# Altium project LimeKEY-RPCM_1v1.PrjPcb (part 7 of 12)

## Sheet 10_RFFE.SchDoc: RF front end
size A3; Organization: Lime Microsystems; Address1: Surrey Tech Centre; Address2: Guildford GU2 7YG; Address3: Surrey; Address4: United Kingdom; Revision: v1.1; SheetNumber: 10; SheetTotal: 12
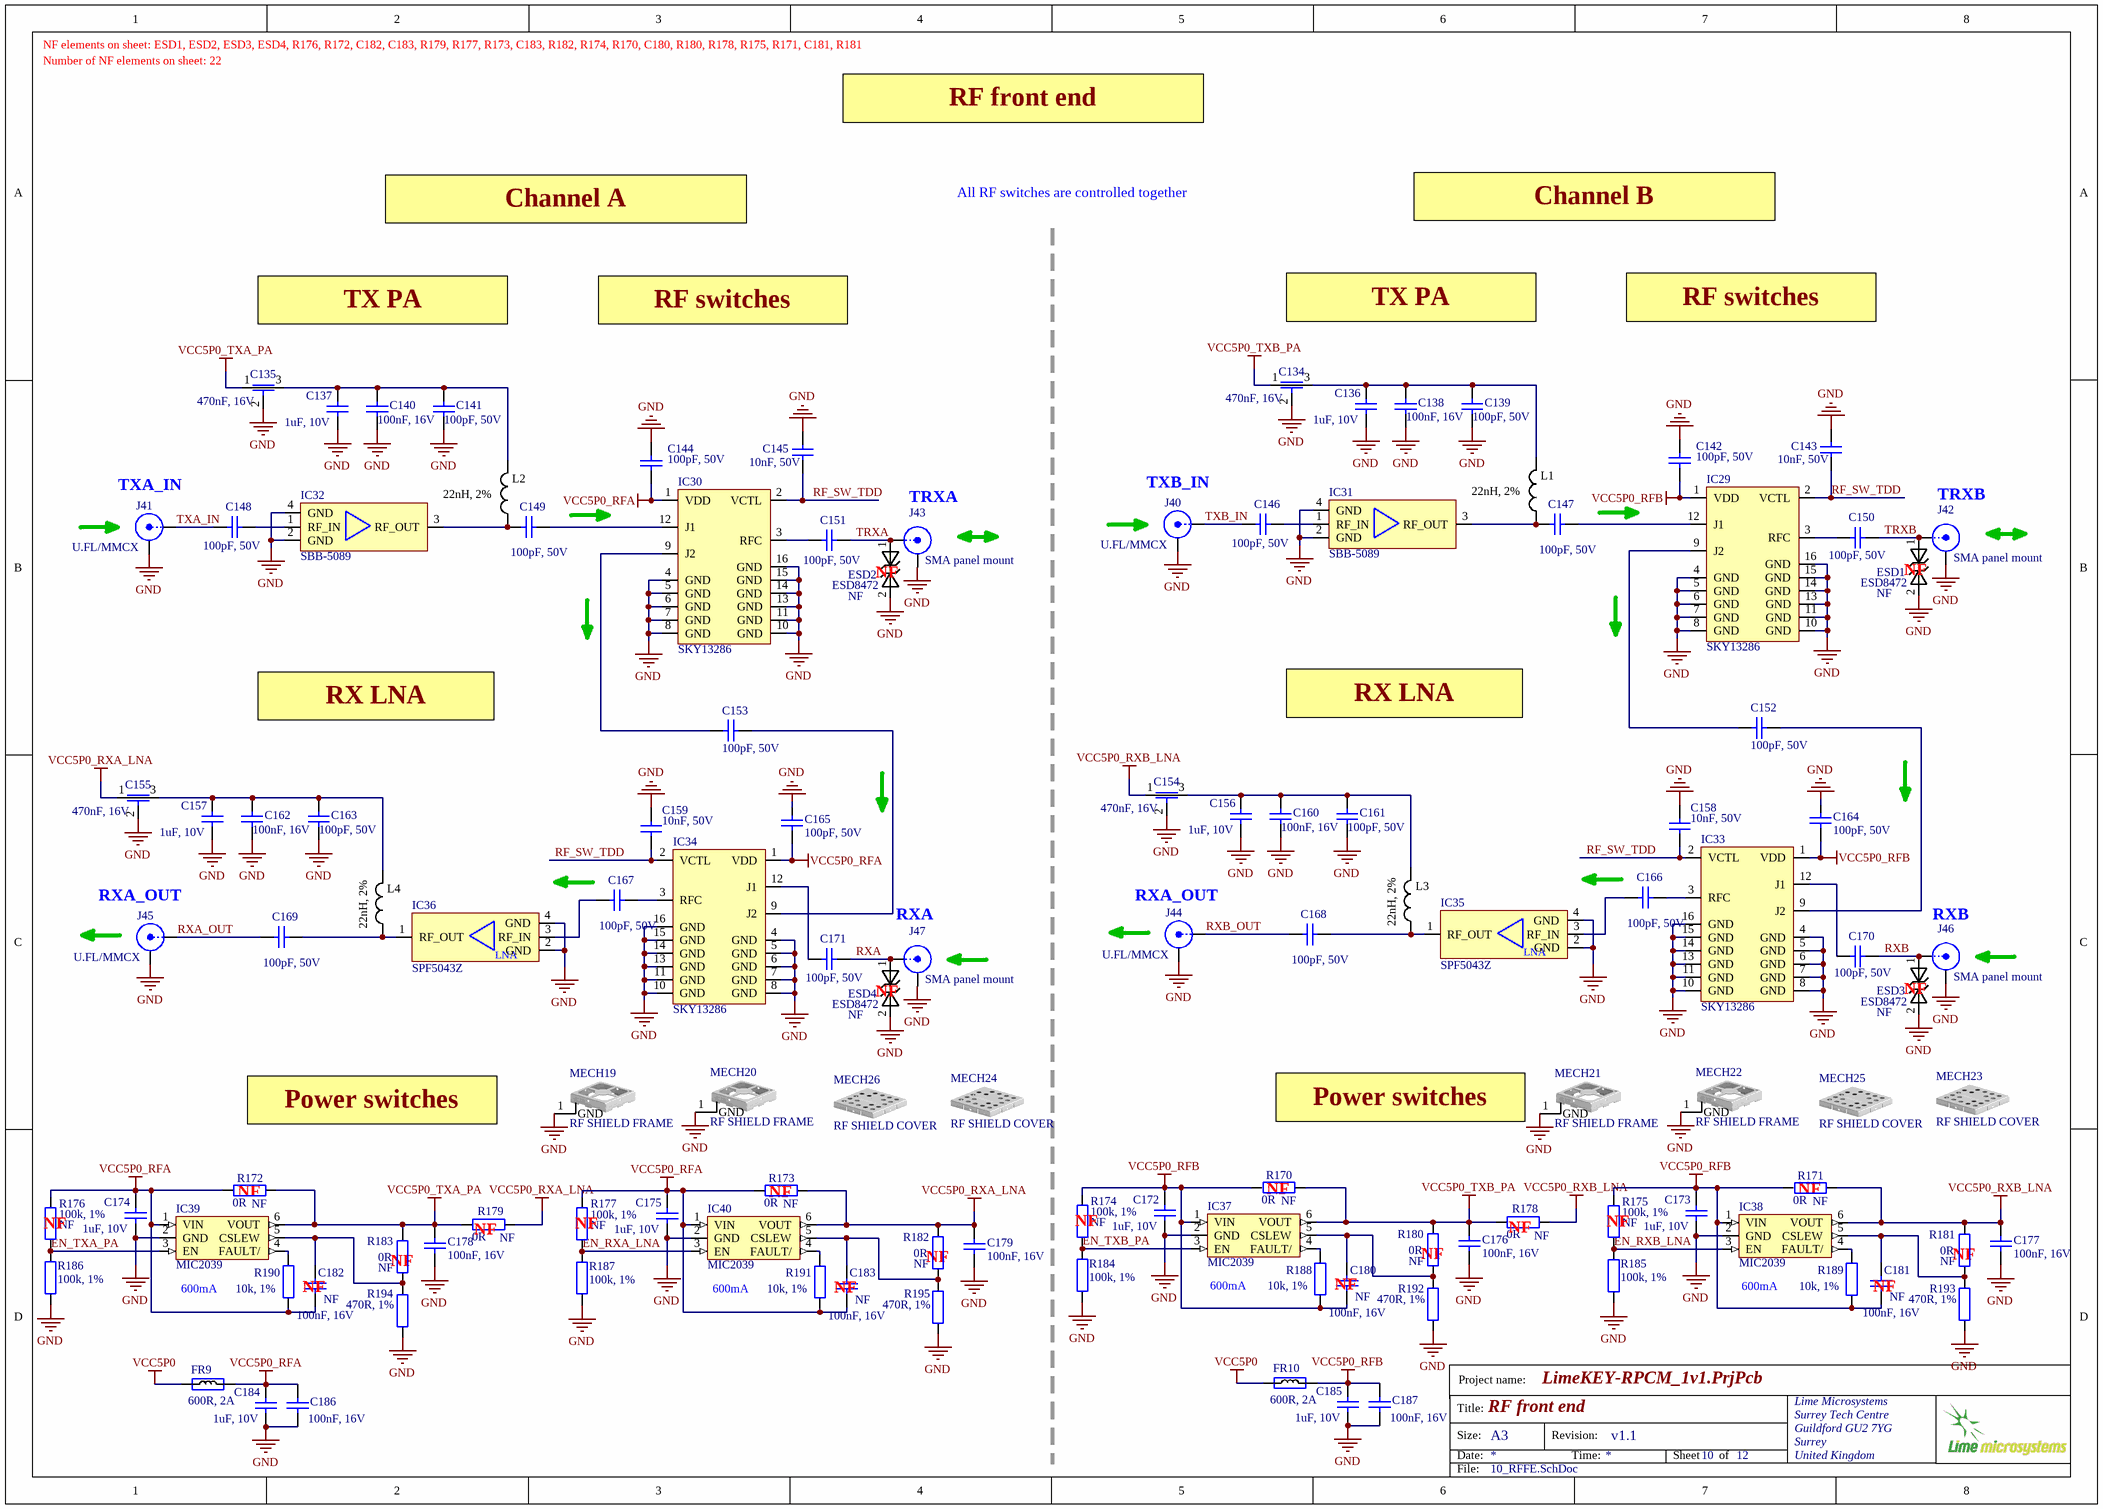
[diagram p9: 10_RFFE.SchDoc]

### Parts
C134  470nF, 16V  [CAP0805_FEEDTHROUGH]
C135  470nF, 16V  [CAP0805_FEEDTHROUGH]
C136  1uF, 10V  [CAP0402]
C137  1uF, 10V  [CAP0402]
C138  100nF, 16V  [CAP0402]
C139  100pF, 50V  [CAP0402]
C140  100nF, 16V  [CAP0402]
C141  100pF, 50V  [CAP0402]
C142  100pF, 50V  [CAP0402]
C143  10nF, 50V  [CAP0402]
C144  100pF, 50V  [CAP0402]
C145  10nF, 50V  [CAP0402]
C146  100pF, 50V  [CAP0402]
C147  100pF, 50V  [CAP0402]
C148  100pF, 50V  [CAP0402]
C149  100pF, 50V  [CAP0402]
C150  100pF, 50V  [CAP0402]
C151  100pF, 50V  [CAP0402]
C152  100pF, 50V  [CAP0402]
C153  100pF, 50V  [CAP0402]
C154  470nF, 16V  [CAP0805_FEEDTHROUGH]
C155  470nF, 16V  [CAP0805_FEEDTHROUGH]
C156  1uF, 10V  [CAP0402]
C157  1uF, 10V  [CAP0402]
C158  10nF, 50V  [CAP0402]
C159  10nF, 50V  [CAP0402]
C160  100nF, 16V  [CAP0402]
C161  100pF, 50V  [CAP0402]
C162  100nF, 16V  [CAP0402]
C163  100pF, 50V  [CAP0402]
C164  100pF, 50V  [CAP0402]
C165  100pF, 50V  [CAP0402]
C166  100pF, 50V  [CAP0402]
C167  100pF, 50V  [CAP0402]
C168  100pF, 50V  [CAP0402]
C169  100pF, 50V  [CAP0402]
C170  100pF, 50V  [CAP0402]
C171  100pF, 50V  [CAP0402]
C172  1uF, 10V  [CAP0402]
C173  1uF, 10V  [CAP0402]
C174  1uF, 10V  [CAP0402]
C175  1uF, 10V  [CAP0402]
C176  100nF, 16V  [CAP0402]
C177  100nF, 16V  [CAP0402]
C178  100nF, 16V  [CAP0402]
C179  100nF, 16V  [CAP0402]
C180  100nF, 16V  Assembly Info: NF  [CAP0402]
C181  100nF, 16V  Assembly Info: NF  [CAP0402]
C182  100nF, 16V  Assembly Info: NF  [CAP0402]
C183  100nF, 16V  Assembly Info: NF  [CAP0402]
C184  1uF, 10V  [CAP0402]
C185  1uF, 10V  [CAP0402]
C186  100nF, 16V  [CAP0402]
C187  100nF, 16V  [CAP0402]
ESD1  ESD8472  Assembly Info: NF  [ESD8472_X3DFN2]
ESD2  ESD8472  Assembly Info: NF  [ESD8472_X3DFN2]
ESD3  ESD8472  Assembly Info: NF  [ESD8472_X3DFN2]
ESD4  ESD8472  Assembly Info: NF  [ESD8472_X3DFN2]
FR9  600R, 2A  [RES0805]
FR10  600R, 2A  [RES0805]
IC29  SKY13286  [SKY13286-359LF_RF_switch_QFN16]
IC30  SKY13286  [SKY13286-359LF_RF_switch_QFN16]
IC31  SBB-5089  [SBB-5089_RF_AMP_SOT89]
IC32  SBB-5089  [SBB-5089_RF_AMP_SOT89]
IC33  SKY13286  [SKY13286-359LF_RF_switch_QFN16]
IC34  SKY13286  [SKY13286-359LF_RF_switch_QFN16]
IC35  SPF5043Z  [SPF5043Z_SOT-343]
IC36  SPF5043Z  [SPF5043Z_SOT-343]
IC37  MIC2039  [SOT23-6]
IC38  MIC2039  [SOT23-6]
IC39  MIC2039  [SOT23-6]
IC40  MIC2039  [SOT23-6]
J40  U.FL/MMCX  [MMCX_UFL_conn_u]
J41  U.FL/MMCX  [MMCX_UFL_conn_u]
J42  SMA panel mount  [SMA_connector_side]
J43  SMA panel mount  [SMA_connector_side]
J44  U.FL/MMCX  [MMCX_UFL_conn_u]
J45  U.FL/MMCX  [MMCX_UFL_conn_u]
J46  SMA panel mount  [SMA_connector_side]
J47  SMA panel mount  [SMA_connector_side]
L1  22nH, 2%  [RES0603]
L2  22nH, 2%  [RES0603]
L3  22nH, 2%  [RES0603]
L4  22nH, 2%  [RES0603]
MECH19  RF SHIELD FRAME  [RF_SHIELD_FRAME_16P5x16P5_2118716-2_v1]
MECH20  RF SHIELD FRAME  [RF_SHIELD_FRAME_16P5x16P5_2118716-2_v1]
MECH21  RF SHIELD FRAME  [RF_SHIELD_FRAME_16P5x16P5_2118716-2_v1]
MECH22  RF SHIELD FRAME  [RF_SHIELD_FRAME_16P5x16P5_2118716-2_v1]
MECH23  RF SHIELD COVER  [RF_SHIELD_COVER_16Px916P9_2118715-2]
MECH24  RF SHIELD COVER  [RF_SHIELD_COVER_16Px916P9_2118715-2]
MECH25  RF SHIELD COVER  [RF_SHIELD_COVER_16Px916P9_2118715-2]
MECH26  RF SHIELD COVER  [RF_SHIELD_COVER_16Px916P9_2118715-2]
R170  0R  Assembly Info: NF  [RES0402]
R171  0R  Assembly Info: NF  [RES0402]
R172  0R  Assembly Info: NF  [RES0402]
R173  0R  Assembly Info: NF  [RES0402]
R174  100k, 1%  Assembly Info: NF  [RES0402]
R175  100k, 1%  Assembly Info: NF  [RES0402]
R176  100k, 1%  Assembly Info: NF  [RES0402]
R177  100k, 1%  Assembly Info: NF  [RES0402]
R178  0R  Assembly Info: NF  [RES0805]
R179  0R  Assembly Info: NF  [RES0805]
R180  0R  Assembly Info: NF  [RES0402]
R181  0R  Assembly Info: NF  [RES0402]
R182  0R  Assembly Info: NF  [RES0402]
R183  0R  Assembly Info: NF  [RES0402]
R184  100k, 1%  [RES0402]
R185  100k, 1%  [RES0402]
R186  100k, 1%  [RES0402]
R187  100k, 1%  [RES0402]
R188  10k, 1%  [RES0402]
R189  10k, 1%  [RES0402]
R190  10k, 1%  [RES0402]
R191  10k, 1%  [RES0402]
R192  470R, 1%  [RES0402]
R193  470R, 1%  [RES0402]
R194  470R, 1%  [RES0402]
R195  470R, 1%  [RES0402]

### Nets
GND: C134.2 C135.2 C136.1 C137.1 C138.2 C139.1 C140.2 C141.1 C142.2 C143.1 C144.2 C145.1 C154.2 C155.2 C156.1 C157.1 C158.2 C159.2 C160.2 C161.1 C162.2 C163.1 C164.2 C165.2 C172.2 C173.2 C174.2 C175.2 C176.2 C177.2 C178.2 C179.2 C184.1 C185.1 C186.2 C187.2 ESD1.2 ESD2.2 ESD3.2 ESD4.2 IC29.4(GND) IC29.5(GND) IC29.6(GND) IC29.7(GND) IC29.8(GND) IC29.10(GND) IC29.11(GND) IC29.13(GND) IC29.14(GND) IC29.15(GND) IC29.16(GND) IC30.4(GND) IC30.5(GND) IC30.6(GND) IC30.7(GND) IC30.8(GND) IC30.10(GND) IC30.11(GND) IC30.13(GND) IC30.14(GND) IC30.15(GND) IC30.16(GND) IC31.2(GND) IC31.4(GND) IC32.2(GND) IC32.4(GND) IC33.4(GND) IC33.5(GND) IC33.6(GND) IC33.7(GND) IC33.8(GND) IC33.10(GND) IC33.11(GND) IC33.13(GND) IC33.14(GND) IC33.15(GND) IC33.16(GND) IC34.4(GND) IC34.5(GND) IC34.6(GND) IC34.7(GND) IC34.8(GND) IC34.10(GND) IC34.11(GND) IC34.13(GND) IC34.14(GND) IC34.15(GND) IC34.16(GND) IC35.2(GND) IC35.4(GND) IC36.2(GND) IC36.4(GND) IC37.2(GND) IC38.2(GND) IC39.2(GND) IC40.2(GND) J40.2(Y) J41.2(Y) J42.2(Y) J43.2(Y) J44.2(Y) J45.2(Y) J46.2(Y) J47.2(Y) MECH19.1(GND) MECH20.1(GND) MECH21.1(GND) MECH22.1(GND) R184.2 R185.2 R186.2 R187.2 R192.1 R193.1 R194.1 R195.1
VCC5P0: FR9.1 FR10.1
VCC5P0_RFA: C144.1 C165.1 C174.1 C175.1 C182.2 C183.2 C184.2 C186.1 FR9.2 IC30.1(VDD) IC34.1(VDD) IC39.1(VIN) IC40.1(VIN) R172.2 R173.2 R176.1 R177.1 R190.1 R191.1
VCC5P0_RFB: C142.1 C164.1 C172.1 C173.1 C180.2 C181.2 C185.2 C187.1 FR10.2 IC29.1(VDD) IC33.1(VDD) IC37.1(VIN) IC38.1(VIN) R170.2 R171.2 R174.1 R175.1 R188.1 R189.1
VCC5P0_RXA_LNA: C155.1 C179.1 IC40.6(VOUT) R173.1 R179.1 R182.2
VCC5P0_RXB_LNA: C154.1 C177.1 IC38.6(VOUT) R171.1 R178.1 R181.2
VCC5P0_TXA_PA: C135.1 C178.1 IC39.6(VOUT) R172.1 R179.2 R183.2
VCC5P0_TXB_PA: C134.1 C176.1 IC37.6(VOUT) R170.1 R178.2 R180.2
EN_RXA_LNA: IC40.3(EN) R177.2 R187.1
EN_RXB_LNA: IC38.3(EN) R175.2 R185.1
EN_TXA_PA: IC39.3(EN) R176.2 R186.1
EN_TXB_PA: IC37.3(EN) R174.2 R184.1
RF_SW_TDD: C143.2 C145.2 C158.1 C159.1 IC29.2(VCTL) IC30.2(VCTL) IC33.2(VCTL) IC34.2(VCTL)
RXA: C171.1 ESD4.1 J47.1(X)
RXA_OUT: C169.2 J45.1(X)
RXB: C170.1 ESD3.1 J46.1(X)
RXB_OUT: C168.2 J44.1(X)
TRXA: C151.1 ESD2.1 J43.1(X)
TRXB: C150.1 ESD1.1 J42.1(X)
TXA_IN: C148.2 J41.1(X)
TXB_IN: C146.2 J40.1(X)
NetC134_3: C134.3 C136.2 C138.1 C139.2 L1.1
NetC135_3: C135.3 C137.2 C140.1 C141.2 L2.1
NetC146_1: C146.1 IC31.1(RF_IN)
NetC147_1: C147.1 IC29.12(J1)
NetC147_2: C147.2 IC31.3(RF_OUT) L1.2
NetC148_1: C148.1 IC32.1(RF_IN)
NetC149_1: C149.1 IC30.12(J1)
NetC149_2: C149.2 IC32.3(RF_OUT) L2.2
NetC150_2: C150.2 IC29.3(RFC)
NetC151_2: C151.2 IC30.3(RFC)
NetC152_1: C152.1 IC33.9(J2)
NetC152_2: C152.2 IC29.9(J2)
NetC153_1: C153.1 IC34.9(J2)
NetC153_2: C153.2 IC30.9(J2)
NetC154_3: C154.3 C156.2 C160.1 C161.2 L3.1
NetC155_3: C155.3 C157.2 C162.1 C163.2 L4.1
NetC166_1: C166.1 IC33.3(RFC)
NetC166_2: C166.2 IC35.3(RF_IN)
NetC167_1: C167.1 IC34.3(RFC)
NetC167_2: C167.2 IC36.3(RF_IN)
NetC168_1: C168.1 IC35.1(RF_OUT) L3.2
NetC169_1: C169.1 IC36.1(RF_OUT) L4.2
NetC170_2: C170.2 IC33.12(J1)
NetC171_2: C171.2 IC34.12(J1)
NetC180_1: C180.1 IC37.5(CSLEW) R180.1 R192.2
NetC181_1: C181.1 IC38.5(CSLEW) R181.1 R193.2
NetC182_1: C182.1 IC39.5(CSLEW) R183.1 R194.2
NetC183_1: C183.1 IC40.5(CSLEW) R182.1 R195.2
NetIC37_4: IC37.4(FAULT/) R188.2
NetIC38_4: IC38.4(FAULT/) R189.2
NetIC39_4: IC39.4(FAULT/) R190.2
NetIC40_4: IC40.4(FAULT/) R191.2

### Notes on the sheet
- NF elements on sheet: ESD1, ESD2, ESD3, ESD4, R176, R172, C182, C183, R179, R177, R173, C183, R182, R174, R170, C180, R180, R178, R175, R171, C181, R181
- Number of NF elements on sheet: 22
- RF front end
- Channel A
- All RF switches are controlled together
- Channel B
- TX PA
- RF switches
- (near J41) TXA_IN
- TRXA
- (near J40) TXB_IN
- TRXB
- (near ESD2) NF
- (near ESD1) NF
- RX LNA
- (near J45) RXA_OUT
- RXA
- (near J44) RXA_OUT
- RXB
- (near ESD4) NF
- (near ESD3) NF
- Power switches
- (near MECH21) Power switches
- (near R170) NF
- (near R171) NF
- (near R176) NF
- (near R172) NF
- (near R179) NF
- (near R177) NF
- (near R173) NF
- (near R182) NF
- (near R174) NF
- (near R180) NF
- (near R178) NF
- (near R175) NF
- (near R181) NF
- (near IC39) 600mA
- NF
- (near R183) NF
- (near IC40) 600mA
- (near IC37) 600mA
- (near IC38) 600mA
- (near C181) NF
- Project name:
- Title:
- Size:
- Date:
- A3
- Revision:
- Time:
- Sheet
- of
- File:
- (in symbol SPF5043Z_RF_LNA) LNA

### Library data of the parts
C134 C135 C154 C155 = Cap_feed_through: Part Description: 0.47µF Feed Through Capacitor 16V 2A 30mOhm 0805 (2012 Metric), 3 PC Pad; Manufacturer: Murata; Manufacturer Part Number 1: NFM21PC474R1C3D; Max Current Rating: 2A; Tolerance: 20%; DC Resistance (DCR): 30mR; Insulation Resistance: 1GR; Value: 470nF, 16V; Supplier 1: Digi-Key; Supplier Part Number 1: 490-2537-1-ND; Stock 1: 220606; Pricing 1: 1=0,25000, 10=0,22900, 25=0,21840, 50=0,21160, 100=0,20450, 250=0,19392, 500=0,16218, 1000=0,12586 (USD); Mount: Surface Mount,PCB; Case/Package: 0805; Weight: 0.000194oz; Case Code (Metric): 2012; Case Code (Imperial): 0805; Min Operating Temperature: -55°C; Max Operating Temperature: 125°C; Package Quantity: 1; Capacitance: 470nF; Packaging: Tape and Reel; Max Voltage Rating (DC): 16V; Current Rating: 2A; Voltage Rating: 16V; Voltage Rating (DC): 16V; Voltage: 16V; Current: 2A; Termination: Flat; Length: 2mm; Height: 0.85mm; Width: 1.25mm; Depth: 1.25mm; Radiation Hardening: No; REACH SVHC: No SVHC; Lead Free: Lead Free; RoHS: Yes
C136 C137 C156 C157 C184 C185 = Cap_0402: CAP CER 1UF 10V X5R 0402; Manufacturer: Yageo; Part Description: 1µF 10V Ceramic Capacitor X5R 0402 (1005 Metric) 0.039" L x 0.020" W (1.00mm x 0.50mm); Manufacturer Part Number 1: CC0402MRX5R6BB105; Notification: Current market demand for these product types have resulted in fluctuating and extending lead times. Lead times may differ.; Tolerance: ±20%; Value: 1uF, 10V; Supplier 1: Digi-Key; Supplier Part Number 1: 311-1732-1-ND; RoHS: RoHS Compliant; Applications: General Purpose; Category: Capacitors; ComponentLink1Description: http://www.yageo.com/documents/recent/UPY-GPHC_X5R_4V-to-50V_25.pdf; ComponentLink1URL: http://www.yageo.com/documents/recent/UPY-GPHC_X5R_4V-to-50V_25.pdf; Failure Rate: -; Features: -; Height - Seated (Max): -; Lead Spacing: -; Lead Style: -; Mounting Type: Surface Mount, MLCC; Operating Temperature: -55°C ~ 85°C; Package / Case: 0402 (1005 Metric); Packaging: Cut Tape (CT); Part Status: Active; Pricing 1: 1=0.22, 10=0.156, 100=0.0732, 500=0.0513, 1000=0.04248, 2500=0.03953, 5000=0.03617 (USD); Ratings: -; Size / Dimension: 0.039" L x 0.020" W (1.00mm x 0.50mm); Stock 1: 69600; Temperature Coefficient: X5R; Thickness (Max): 0.022" (0.55mm); Voltage - Rated: 10V
C138 C140 C160 C162 C176-C183 = Cap_0402: Manufacturer: Murata Electronics; Manufacturer Part Number 1: GRM155R71C104KA88D; Part Description: 0.10µF ±10% 16V Ceramic Capacitor X7R 0402 (1005 Metric); Tolerance: 10 %; Type: General Purpose MLCC; Capacitance: 0.1 uF; Case Length: 1 mm; Dielectric: X7R; Case Height: 0.5 mm; Temperature Coefficient / Code: +/- 15 %; Value: 100nF, 16V; Supplier 1: Mouser; Supplier Part Number 1: 81-GRM155R71C104KA88; Case Code - in: 0402; RoHS: RoHS Compliant; Operating Temperature Range: - 55 C to + 125 C; Series: GRM; Termination Style: SMD/SMT; Package / Case: 0402 (1005 metric); Voltage Rating DC: 16 V; Maximum Operating Temperature: + 125 C; Case Code - mm: 1005; Minimum Operating Temperature: - 55 C; Product Category: Low & Medium Capacitance SMD Ceramic Chip Capacitors; Packaging: Reel; Product: General Type MLCCs; Category: Multilayer Ceramic Capacitors MLCC - SMD/SMT; Brand: Murata Electronics; Case Width: 0.5 mm; RoHS - Mouser: Y; Standard Pack Qty: 10000; Minimum Order Quantity: 1; Reeling: True; Manufacturer Part Number: GRM155R71C104KA88D
C139 C141 C142 C144 C146-C153 C161 C163-C171 = Cap_0402: Manufacturer Part Number 1: CC0402JRNPO9BN101; Manufacturer: Yageo; Part Description: 100pF ±5% 50V C0G, NP0 Ceramic Capacitor -55°C ~ 125°C Surface Mount, MLCC 0402 (1005 Metric) 0.039" L x 0.020" W (1.00mm x 0.50mm); Tolerance: ±5%; Temperature Coefficient: C0G, NP0; Value: 100pF, 50V; Capacitance: 100pF; Thickness (Max): 0.022" (0.55mm); Size / Dimension: 0.039" L x 0.020" W (1.00mm x 0.50mm); RoHS: RoHS Compliant; Ratings: -; Package / Case: 0402 (1005 Metric); Mounting Type: Surface Mount, MLCC; Height - Seated (Max): -; Features: -; Lead Spacing: -; Voltage - Rated: 50V; Operating Temperature: -55°C ~ 125°C; Packaging: Cut Tape (CT); Applications: General Purpose; Lead Style: -; Supplier 1: Digi-Key; Category: Capacitors; Supplier Part Number 1: 311-1024-1-ND
C143 C145 C158 C159 = Cap_0402: Part Description: 10000pF ±10% 50V Ceramic Capacitor X7R 0402 (1005 Metric); Manufacturer: Murata Electronics North America; Manufacturer Part Number 1: GRM155R71H103KA88D; Tolerance: ±10%; Temperature Coefficient: X7R; Value: 10nF, 50V; Supplier 1: Digi-Key; Supplier Part Number 1: 490-4516-2-ND; RoHS: RoHS Compliant; Category: Capacitors; Stock 1: 10970000; Pricing 1: 10000=0.00185, 20000=0.00176, 30000=0.00167 (USD); Packaging: Tape & Reel (TR); Part Status: Active; Voltage - Rated: 50V; Operating Temperature: -55°C ~ 125°C; Features: -; Ratings: -; Applications: General Purpose; Mounting Type: Surface Mount, MLCC; Package / Case: 0402 (1005 Metric); Size / Dimension: 0.039" L x 0.020" W (1.00mm x 0.50mm); Height - Seated (Max): -; Thickness (Max): 0.022" (0.55mm); Lead Spacing: -; Lead Style: -; ComponentLink1URL: http://www.murata.com/~/media/webrenewal/support/library/catalog/products/capacitor/mlcc/c02e.ashx?la=en-us; ComponentLink1Description: http://www.murata.com/~/media/webrenewal/support/library/catalog/products/capacitor/mlcc/c02e.ashx?la=en-us
C172-C175 = Cap_0402: Manufacturer Part Number 1: CC0402MRX5R6BB105; Manufacturer: Yageo; Part Description: 1µF 10V Ceramic Capacitor X5R 0402 (1005 Metric) 0.039" L x 0.020" W (1.00mm x 0.50mm); Voltage Rating: 10; Capacitance Tolerance: ± 10%; Product Range: TDK - C Series; Ceramic Capacitor Case: 0402 [1005 Metric]; Capacitance: 1; Dielectric Characteristic: X6; Value: 1uF, 10V; Supplier 1: Digi-Key; Supplier Part Number 1: 311-1732-1-ND; MSL: -; RoHS: YES
C186 C187 = Cap_0603: Manufacturer Part Number 1: GRM155R71C104KA88D; Part Description: 0.10µF ±10% 16V Ceramic Capacitor X7R 0402 (1005 Metric); Brand: Murata Electronics; Tolerance: 10 %; Type: General Purpose MLCC; Capacitance: 0.1 uF; Temperature Coefficient / Code: +/- 15 %; Case Height: 0.5 mm; Case Length: 1 mm; Dielectric: X7R; Supplier 1: Mouser; Supplier Part Number 1: 81-GRM155R71C104KA88; Case Code - in: 0402; Manufacturer: Murata Electronics; Category: Multilayer Ceramic Capacitors MLCC - SMD/SMT; Voltage Rating DC: 16 V; Value: 100nF, 16V; Manufacturer Part Number: GRM155R71C104KA88D; Case Code - mm: 1005; Case Width: 0.5 mm; Maximum Operating Temperature: + 125 C; Minimum Operating Temperature: - 55 C; Minimum Order Quantity: 1; Operating Temperature Range: - 55 C to + 125 C; Package / Case: 0402 (1005 metric); Packaging: Reel; Product: General Type MLCCs; Product Category: Low & Medium Capacitance SMD Ceramic Chip Capacitors; Reeling: True; RoHS - Mouser: Y; RoHS: RoHS Compliant; Series: GRM; Standard Pack Qty: 10000; Termination Style: SMD/SMT
ESD1-ESD4 = ESD8472: Manufacturer: ON Semiconductor; Manufacturer Part Number 1: ESD8472MUT5G; Part Description: TVS DIODE 5.3VWM 14VC X3DFN2; Voltage - Reverse Standoff (Typ): 5.3V (Max); Voltage - Breakdown (Min): 7V; Voltage - Clamping (Max) @ Ipp: 14V; Current - Peak Pulse (10/1000µs): 3A (8/20µs); Power Line Protection: No; Capacitance @ Frequency: 0.2pF @ 1MHz; Supplier 1: Digi-Key; RoHS: RoHS Compliant; Category: Circuit Protection; Stock 1: 2295; Pricing 1: 1=0.39, 10=0.315, 100=0.2142, 500=0.16068, 1000=0.12051 (USD); Packaging: Cut Tape (CT); Part Status: Active; Type: Zener; Power - Peak Pulse: -; Applications: Automotive, RF Antenna; Operating Temperature: -55°C ~ 150°C (TJ); Mounting Type: Surface Mount; Package / Case: 2-XFDFN; Supplier Device Package: 2-X3DFN (0.62x0.32); ComponentLink1URL: http://www.onsemi.com/pub/Collateral/ESD8472-D.PDF; ComponentLink1Description: http://www.onsemi.com/pub/Collateral/ESD8472-D.PDF; Supplier Part Number 1: ESD8472MUT5GOSCT-ND
FR9 FR10 = Ferrite: Manufacturer Part Number 1: MPZ2012S601AT000; Manufacturer: TDK Corporation; Part Description: FERRITE BEAD 600 OHM 0805 1LN; Filter Type: Differential Mode - Single; Impedance @ Frequency: 600 Ohm @ 100MHz; DC Resistance (DCR): 100 mOhm Max; Supplier 1: Digi-Key; Supplier Part Number 1: 445-2206-2-ND; Mounting Type: Surface Mount; RoHS: RoHS Compliant; Height (Max): 0.041" (1.05mm); Packaging: Tape & Reel (TR); Category: Filters; Current Rating: 2A; Package / Case: 0805 (2012 Metric); Size / Dimension: 0.079" L x 0.049" W (2.00mm x 1.25mm); Value: 600R, 2A
IC29 IC30 IC33 IC34 = SKY13286-359LF_RF_switch: Part Description: RF Switch IC GSM, ISM, PCS, WCDMA SPDT 6 GHz 50Ohm 16-QFN (4x4); Manufacturer: Skyworks Solutions; Frequency: 6GHz; Impedance: 50R; Insertion Loss: 1.8dB; Turn-Off Delay Time: 50ns; Throw Configuration: SPDT; IIP3: 46dBm; Operating Frequency: 100 MHz to 6 GHz; Number of Switches: 3; Min Supply Voltage: 2.7V; Max Supply Voltage: 5.5V; P1dB: 30dBm; Min Frequency: 100MHz; Supplier 1: Digi-Key; Supplier Part Number 1: 863-1049-1-ND; Manufacturer Part Number 1: SKY13286-359LF; Stock 1: 60609; Pricing 1: 1=3,45000, 10=3,09600, 25=2,92720, 100=2,53700, 250=2,40684, 500=2,15966, 1000=1,95150 (USD); RoHS: Yes; Mount: Surface Mount; Case/Package: QFN; Number of Pins: 16; Contact Plating: Tin,Matte; Min Operating Temperature: -40°C; Max Operating Temperature: 95°C; Package Quantity: 1; Packaging: Tape and Reel; Turn-On Delay Time: 50ns; Max Frequency: 6GHz; Series: -; Termination: SMD/SMT; Radiation Hardening: No; RoHS Compliant: Yes; REACH SVHC: Unknown; ComponentLink1URL: https://datasheet.ciiva.com/15100/getdatasheetpartid-656005-15100455.pdf?src-supplier=Verical; ComponentLink1Description: https://datasheet.ciiva.com/15100/getdatasheetpartid-656005-15100455.pdf?src-supplier=Verical; ComponentLink2URL: https://datasheet.ciiva.com/12080/200570h-20342-12080171.pdf?src-supplier=Mouser; ComponentLink2Description: https://datasheet.ciiva.com/12080/200570h-20342-12080171.pdf?src-supplier=Mouser
IC31 IC32 = SBB-5089_RF_AMP: Part Description: RF Amplifier .05-6GHz SSG 20.5dB NF 3.9dB; Manufacturer: Qorvo; Manufacturer Part Number 1: SBB5089Z; Supplier 1: Mouser; Supplier Part Number 1: 772-SBB5089Z; Stock 1: 59301; Pricing 1: 1=4,83000, 10=4,83000, 50=3,70000, 100=2,89000, 1000=2,89000, 10000=2,89000 (USD); RoHS: No
IC35 IC36 = SPF5043Z_RF_LNA: Part Description: RF Amplifier .05-4GHz SSG 12.9dB NF .8dB GaAs; Manufacturer: Qorvo; Supplier 1: Mouser; Supplier Part Number 1: 772-SPF5043Z; Manufacturer Part Number 1: SPF5043Z; Stock 1: 151851; Pricing 1: 1=3,68000, 10=3,68000, 50=2,67000, 100=2,17000, 1000=1,20000, 10000=1,06000 (USD); RoHS: Yes; RoHS Compliant: Yes
IC37-IC40 = MIC2033_power_switch: Part Description: Power Switch/Driver 1:1 P-Channel 2.5A SOT-23-6; Manufacturer: Microchip; Manufacturer Part Number 1: MIC2039EYM6-TR; Number of Outputs: 1; Interface: On/Off; Max Output Current: 2.5A; Fault Protection: Over Temperature; Output Configuration: High Side; ComponentLink1URL: http://www.mouser.com/ds/2/268/mic2033-b-1076865.pdf?src-supplier=Mouser; ComponentLink1Description: http://www.mouser.com/ds/2/268/mic2033-b-1076865.pdf?src-supplier=Mouser; ComponentLink2URL: http://components.arrow.com/part/dataview/56727820S413982N1374?src-supplier=Arrow+Electronics; ComponentLink2Description: http://components.arrow.com/part/dataview/56727820S413982N1374?src-supplier=Arrow+Electronics; ComponentLink3URL: http://www.microchip.com/mymicrochip/filehandler.aspx?ddocname=en579457&src-supplier=Digi-Key; ComponentLink3Description: http://www.microchip.com/mymicrochip/filehandler.aspx?ddocname=en579457&src-supplier=Digi-Key; Supplier 1: Digi-Key; Supplier Part Number 1: 576-4193-1-ND; Stock 1: 37195; Pricing 1: 1=0,98000, 25=0,80560, 100=0,75000 (USD); RoHS: No; Case/Package: SOT-23-6; Min Operating Temperature: -40°C; Max Operating Temperature: 125°C; Package Quantity: 3000; Packaging: Tape and Reel; Series: -; ComponentLink4URL: https://datasheet.ciiva.com/6607/mic2039-6607725.pdf?src-supplier=Digi-Key; ComponentLink4Description: https://datasheet.ciiva.com/6607/mic2039-6607725.pdf?src-supplier=Digi-Key
J40 J41 J44 J45 = RF_IF_connector: CONN UMC RCPT STR 50 OHM SMD; Manufacturer: Molex, LLC; Manufacturer Part Number 1: 0734120110; Body Finish: Nickel; Body Material: Phosphor Bronze; Center Contact Material: Brass; Center Contact Plating: Gold; Connector Style: Ultra Miniature Coaxial; Connector Type: Jack, Male Pin; Contact Termination: Solder; Dielectric Material: Liquid Crystal Polymer (LCP); Frequency - Max: 6GHz; Impedance: 50 Ohm; Voltage Rating: 60V; Cable Group: -; Category: Connectors, Interconnects; Fastening Type: Snap-On; Features: -; Housing Color: Silver; Ingress Protection: -; Mounting Type: Surface Mount; Operating Temperature: -40°C ~ 90°C; Packaging: Cut Tape (CT); RoHS: RoHS Compliant; Shield Termination: Solder; Supplier 1: Digi-Key; Supplier Part Number 1: WM5587CT-ND; Part Description: CONN UMC RCPT STR 50 OHM SMD
J42 J43 J46 J47 = RF_IF_connector: CONN SMA JACK STR 50OHM EDGE MNT; Manufacturer: Linx; Manufacturer Part Number 1: CONSMA002-L-G; Part Description: SMA Connector Receptacle, Female Socket 50Ohm Panel Mount, Through Hole, Right Angle Solder; Supplier 1: Digi-Key; Supplier Part Number 1: CONSMA002-L-G-ND; Stock 1: 815; Pricing 1: 1=4.08, 25=3.67, 100=3.32, 250=3.25, 500=3, 1000=2.80001, 2000=2.5875 (USD)
L1-L4 = Inductor: Manufacturer: Murata; Manufacturer Part Number 1: LQW18AN22NG00D; Part Description: Fixed Inductors 22 NH 2%; Core Material: Non-Magnetic; Self Resonant Frequency: 4.6GHz; Shielding: Unshielded; Q Factor: 40; Current Rating: 500mA; DC Resistance (DCR): 170mR; Test Frequency: 100MHz; Current: 400mA; Value: 22nH, 2%; ComponentLink1URL: http://productfinder.pulseeng.com/products/datasheets/WC701.pdf; ComponentLink1Description: http://productfinder.pulseeng.com/products/datasheets/WC701.pdf; Parameter 1: *; Supplier 1: Digi-Key; Supplier Part Number 1: 490-6874-1-ND; Stock 1: 60315; Pricing 1: 1=0,18000, 10=0,16300, 25=0,14520, 50=0,12340, 100=0,10890, 250=0,09984, 500=0,09076, 1000=0,07623 (USD); RoHS: Yes; Mount: Surface Mount; Case/Package: 0603; Number of Pins: 2; Weight: 0.000106oz; Case Code (Metric): 1608; Case Code (Imperial): 0603; Min Operating Temperature: -55°C; Max Operating Temperature: 125°C; Tolerance: 2%; Inductance Tolerance: 2%; Packaging: Tape and Reel; Package Quantity: 4000; Inductance: 22nH; Max DC Current: 500mA; Termination: SMD/SMT; Resistor Type: Wirewound; DC Current: 500mA; Series Resistance: 170mR; Series: LQW18A_00; Rated Current-Max: 500mA; Length: 1.6mm; Width: 0.8mm; Height: 0.8mm; Height - Seated (Max): 0.039inch; Depth: 1mm; REACH SVHC: No SVHC; Military Standard: Not; Lead Free: Lead Free; RoHS Compliant: Yes; ComponentLink2URL: https://datasheet.ciiva.com/11799/0900766b80a002db-11799279.pdf?src-supplier=RSComponents; ComponentLink2Description: https://datasheet.ciiva.com/11799/0900766b80a002db-11799279.pdf?src-supplier=RSComponents; ComponentLink3URL: https://datasheet.ciiva.com/14124/qhlqw18a-data-e-14124619.pdf?src-supplier=Distrelec; ComponentLink3Description: https://datasheet.ciiva.com/14124/qhlqw18a-data-e-14124619.pdf?src-supplier=Distrelec; ComponentLink4URL: https://datasheet.ciiva.com/6705/l0075s0080lqw18a-00-6705627.pdf?src-supplier=Digi-Key; ComponentLink4Description: https://datasheet.ciiva.com/6705/l0075s0080lqw18a-00-6705627.pdf?src-supplier=Digi-Key; ComponentLink5URL: https://datasheet.ciiva.com/6705/l0075s0080lqw18a-00-6705626.pdf?src-supplier=Digi-Key; ComponentLink5Description: https://datasheet.ciiva.com/6705/l0075s0080lqw18a-00-6705626.pdf?src-supplier=Digi-Key; ComponentLink6URL: https://datasheet.ciiva.com/6705/l0075s0080lqw18a-00-6705631.pdf?src-supplier=Digi-Key; ComponentLink6Description: https://datasheet.ciiva.com/6705/l0075s0080lqw18a-00-6705631.pdf?src-supplier=Digi-Key; ComponentLink7URL: https://datasheet.ciiva.com/4977/product-4977173.pdf?src-supplier=Mouser; ComponentLink7Description: https://datasheet.ciiva.com/4977/product-4977173.pdf?src-supplier=Mouser; ComponentLink8URL: https://datasheet.ciiva.com/46391/1487239-46391853.pdf?src-supplier=Element14; ComponentLink8Description: https://datasheet.ciiva.com/46391/1487239-46391853.pdf?src-supplier=Element14; ComponentLink9URL: https://datasheet.ciiva.com/8507/l0075s0080lqw18a-00-8507496.pdf?src-supplier=Avnet; ComponentLink9Description: https://datasheet.ciiva.com/8507/l0075s0080lqw18a-00-8507496.pdf?src-supplier=Avnet
MECH19-MECH22 = RF_SHIELD_FRAME_16P5x16P5_2118716-2: Part Description: RF Shield Frame 0.650" (16.50mm) X 0.650" (16.50mm) Surface Mount; Manufacturer: TE Connectivity; Supplier 1: Digi-Key; Supplier Part Number 1: A126152CT-ND; Manufacturer Part Number 1: 2118716-2; Stock 1: 26553; Pricing 1: 1=0,93000, 10=0,81600, 25=0,76680, 100=0,62570, 250=0,58120 (USD); RoHS: Yes; ComponentLink1URL: https://www.te.com/commerce/DocumentDelivery/DDEController?Action=srchrtrv&DocNm=2118716&DocType=Customer+Drawing&DocLang=English&src-supplier=Digi-Key; ComponentLink1Description: https://www.te.com/commerce/DocumentDelivery/DDEController?Action=srchrtrv&DocNm=2118716&DocType=Customer+Drawing&DocLang=English&src-supplier=Digi-Key
MECH23-MECH26 = RF_SHIELD_COVER_16P9x16P9_2118715-2: Part Description: RF Shield Cover 0.665" (16.90mm) X 0.665" (16.90mm) Vented Surface Mount; Manufacturer: TE Connectivity; ComponentLink1URL: https://www.te.com/commerce/DocumentDelivery/DDEController?Action=srchrtrv&DocNm=2118716&DocType=Customer+Drawing&DocLang=English&src-supplier=Digi-Key; ComponentLink1Description: https://www.te.com/commerce/DocumentDelivery/DDEController?Action=srchrtrv&DocNm=2118716&DocType=Customer+Drawing&DocLang=English&src-supplier=Digi-Key; Supplier 1: Digi-Key; Supplier Part Number 1: A126120-ND; Manufacturer Part Number 1: 2118715-2; Stock 1: 58094; Pricing 1: 1=1,44000, 10=1,28900, 25=1,22400, 100=1,00530, 250=0,93972, 500=0,83046, 1000=0,65562, 2500=0,61191, 5000=0,58132 (USD); RoHS: Yes; ComponentLink2URL: https://www.te.com/commerce/DocumentDelivery/DDEController?Action=srchrtrv&DocNm=2118715&DocType=Customer+Drawing&DocLang=English&src-supplier=Digi-Key; ComponentLink2Description: https://www.te.com/commerce/DocumentDelivery/DDEController?Action=srchrtrv&DocNm=2118715&DocType=Customer+Drawing&DocLang=English&src-supplier=Digi-Key
R170-R173 R180-R183 = Res_0402: Manufacturer Part Number 1: RC0402JR-070RL; Manufacturer: Yageo; Part Description: RES SMD 0.0OHM JUMPER 1/16W 0402; Resistance (Ohms): 0.0; Tolerance: Jumper; Power (Watts): 0.063W, 1/16W; Value: 0R; Supplier 1: Digi-Key; Supplier Part Number 1: 311-0.0JRTR-ND; Category: Resistors; Temperature Coefficient: -; Features: Moisture Resistant; Supplier Device Package: 0402; Height: 0.016" (0.40mm); Package / Case: 0402 (1005 Metric); Operating Temperature: -55°C ~ 155°C; Size / Dimension: 0.039" L x 0.020" W (1.00mm x 0.50mm); Composition: Thick Film; Packaging: Tape & Reel (TR); Number of Terminations: 2; RoHS: RoHS Compliant
R174-R177 R184-R187 = Res_0402: Part Description: 100 kOhms ±1% 0.063W, 1/16W Chip Resistor 0402 (1005 Metric) Thick Film; Manufacturer: Vishay; Manufacturer Part Number 1: CRCW0402100KFKEDC; Power Rating: 62.5mW; Resistance: 100kR; Temperature Coefficient: 100ppm/°C; Value: 100k, 1%; Supplier 1: Digi-Key; Supplier Part Number 1: 541-3960-6-ND; Stock 1: 702107; Pricing 1: 1=0,10000, 10=0,03300, 100=0,01360, 1000=0,00610, 2500=0,00529, 5000=0,00437 (USD); RoHS: Yes; Mount: Surface Mount; Case/Package: SMD/SMT; Contact Plating: Tin; Min Operating Temperature: -55°C; Max Operating Temperature: 155°C; Tolerance: 1%; Resistor Type: Thick Film; Termination: Wraparound; Length: 1mm; Lead Free: Lead Free; RoHS Compliant: Yes; ComponentLink1URL: http://www.vishay.com/docs/28773/crcwce3.pdf?src-supplier=Digi-Key; ComponentLink1Description: http://www.vishay.com/docs/28773/crcwce3.pdf?src-supplier=Digi-Key
R178 R179 = Res_0402: Manufacturer Part Number 1: CRCW08050000Z0EA; Manufacturer: Vishay Dale; Part Description: RES SMD 0.0 OHM JUMPER 1/8W 0805; Power (Watts): 0.125W, 1/8W; Resistance (Ohms): 0.0; Tolerance: Jumper; Value: 0R; Supplier 1: Digi-Key; Supplier Part Number 1: 541-0.0ATR-ND; Package / Case: 0805 (2012 Metric); Height: 0.020" (0.50mm); Packaging: Tape & Reel (TR); Operating Temperature: -55°C ~ 155°C; Temperature Coefficient: -; RoHS: RoHS Compliant; Size / Dimension: 0.079" L x 0.049" W (2.00mm x 1.25mm); Supplier Device Package: 0805 (2012 Metric); Number of Terminations: 2; Category: Resistors; Features: Automotive AEC-Q200; Composition: Thick Film
R188-R191 = Res_0402: Manufacturer: Yageo; Manufacturer Part Number 1: RC0402FR-0710KL; Part Description: RES SMD 10K OHM 1% 1/16W 0402; Temperature Coefficient: ±100ppm/°C; Power (Watts): 0.063W, 1/16W; Value: 10k, 1%; Supplier 1: Digi-Key; Supplier Part Number 1: 311-10.0KLRTR-ND; Resistance (Ohms): 10k; Packaging: Tape & Reel (TR); RoHS: RoHS Compliant; Package / Case: 0402 (1005 Metric); Tolerance: ±1%; Operating Temperature: -55°C ~ 155°C; Size / Dimension: 0.039" L x 0.020" W (1.00mm x 0.50mm); Number of Terminations: 2; Category: Resistors; Height: 0.016" (0.40mm); Supplier Device Package: 0402; Features: Moisture Resistant; Composition: Thick Film
R192-R195 = Res_0402: Manufacturer 1: Yageo; Manufacturer Part Number 1: RC0402FR-07470RL; Part Description: 470 Ohms ±1% 0.063W, 1/16W Chip Resistor 0402 (1005 Metric) Moisture Resistant Thick Film; Power Rating: 62.5mW; Temperature Coefficient: 100ppm/°C; Voltage Rating: 50V; Max Power Dissipation: 63mW; Value: 470R, 1%; Supplier 1: Digi-Key; Supplier Part Number 1: 311-470LRCT-ND; Stock 1: 1652476; Pricing 1: 1=0,10000, 10=0,01600, 100=0,00660, 1000=0,00299, 2500=0,00259, 5000=0,00214 (USD); RoHS: Yes; Case/Package: 0402; Case Code (Metric): 1005; Case Code (Imperial): 0402; Size Code: 0402; Min Operating Temperature: -55°C; Max Operating Temperature: 155°C; Packaging: Tape and Reel; Tolerance: 1%; Resistance: 470R; Number of Terminations: 2; Features: Moisture Resistant; Package Quantity: 1; Resistor Type: Thick Film; Termination: SMD/SMT; Series: RC; Resistance Tolerance: 1%; Construction: Rectangular; Length: 1mm; Width: 0.02inch; Height: 0.016inch; Depth: 0.5mm; Lead Free: Lead Free; REACH SVHC: Unknown; Military Standard: Not; RoHS Compliant: Yes; Manufacturer: Yageo

## Sheet 11_PoE_USB_PD.SchDoc: PoE and USB PD
size A3; Organization: Lime Microsystems; Address1: Surrey Tech Centre; Address2: Guildford GU2 7YG; Address3: Surrey; Address4: United Kingdom; Revision: v1.1; SheetNumber: 11; SheetTotal: 12
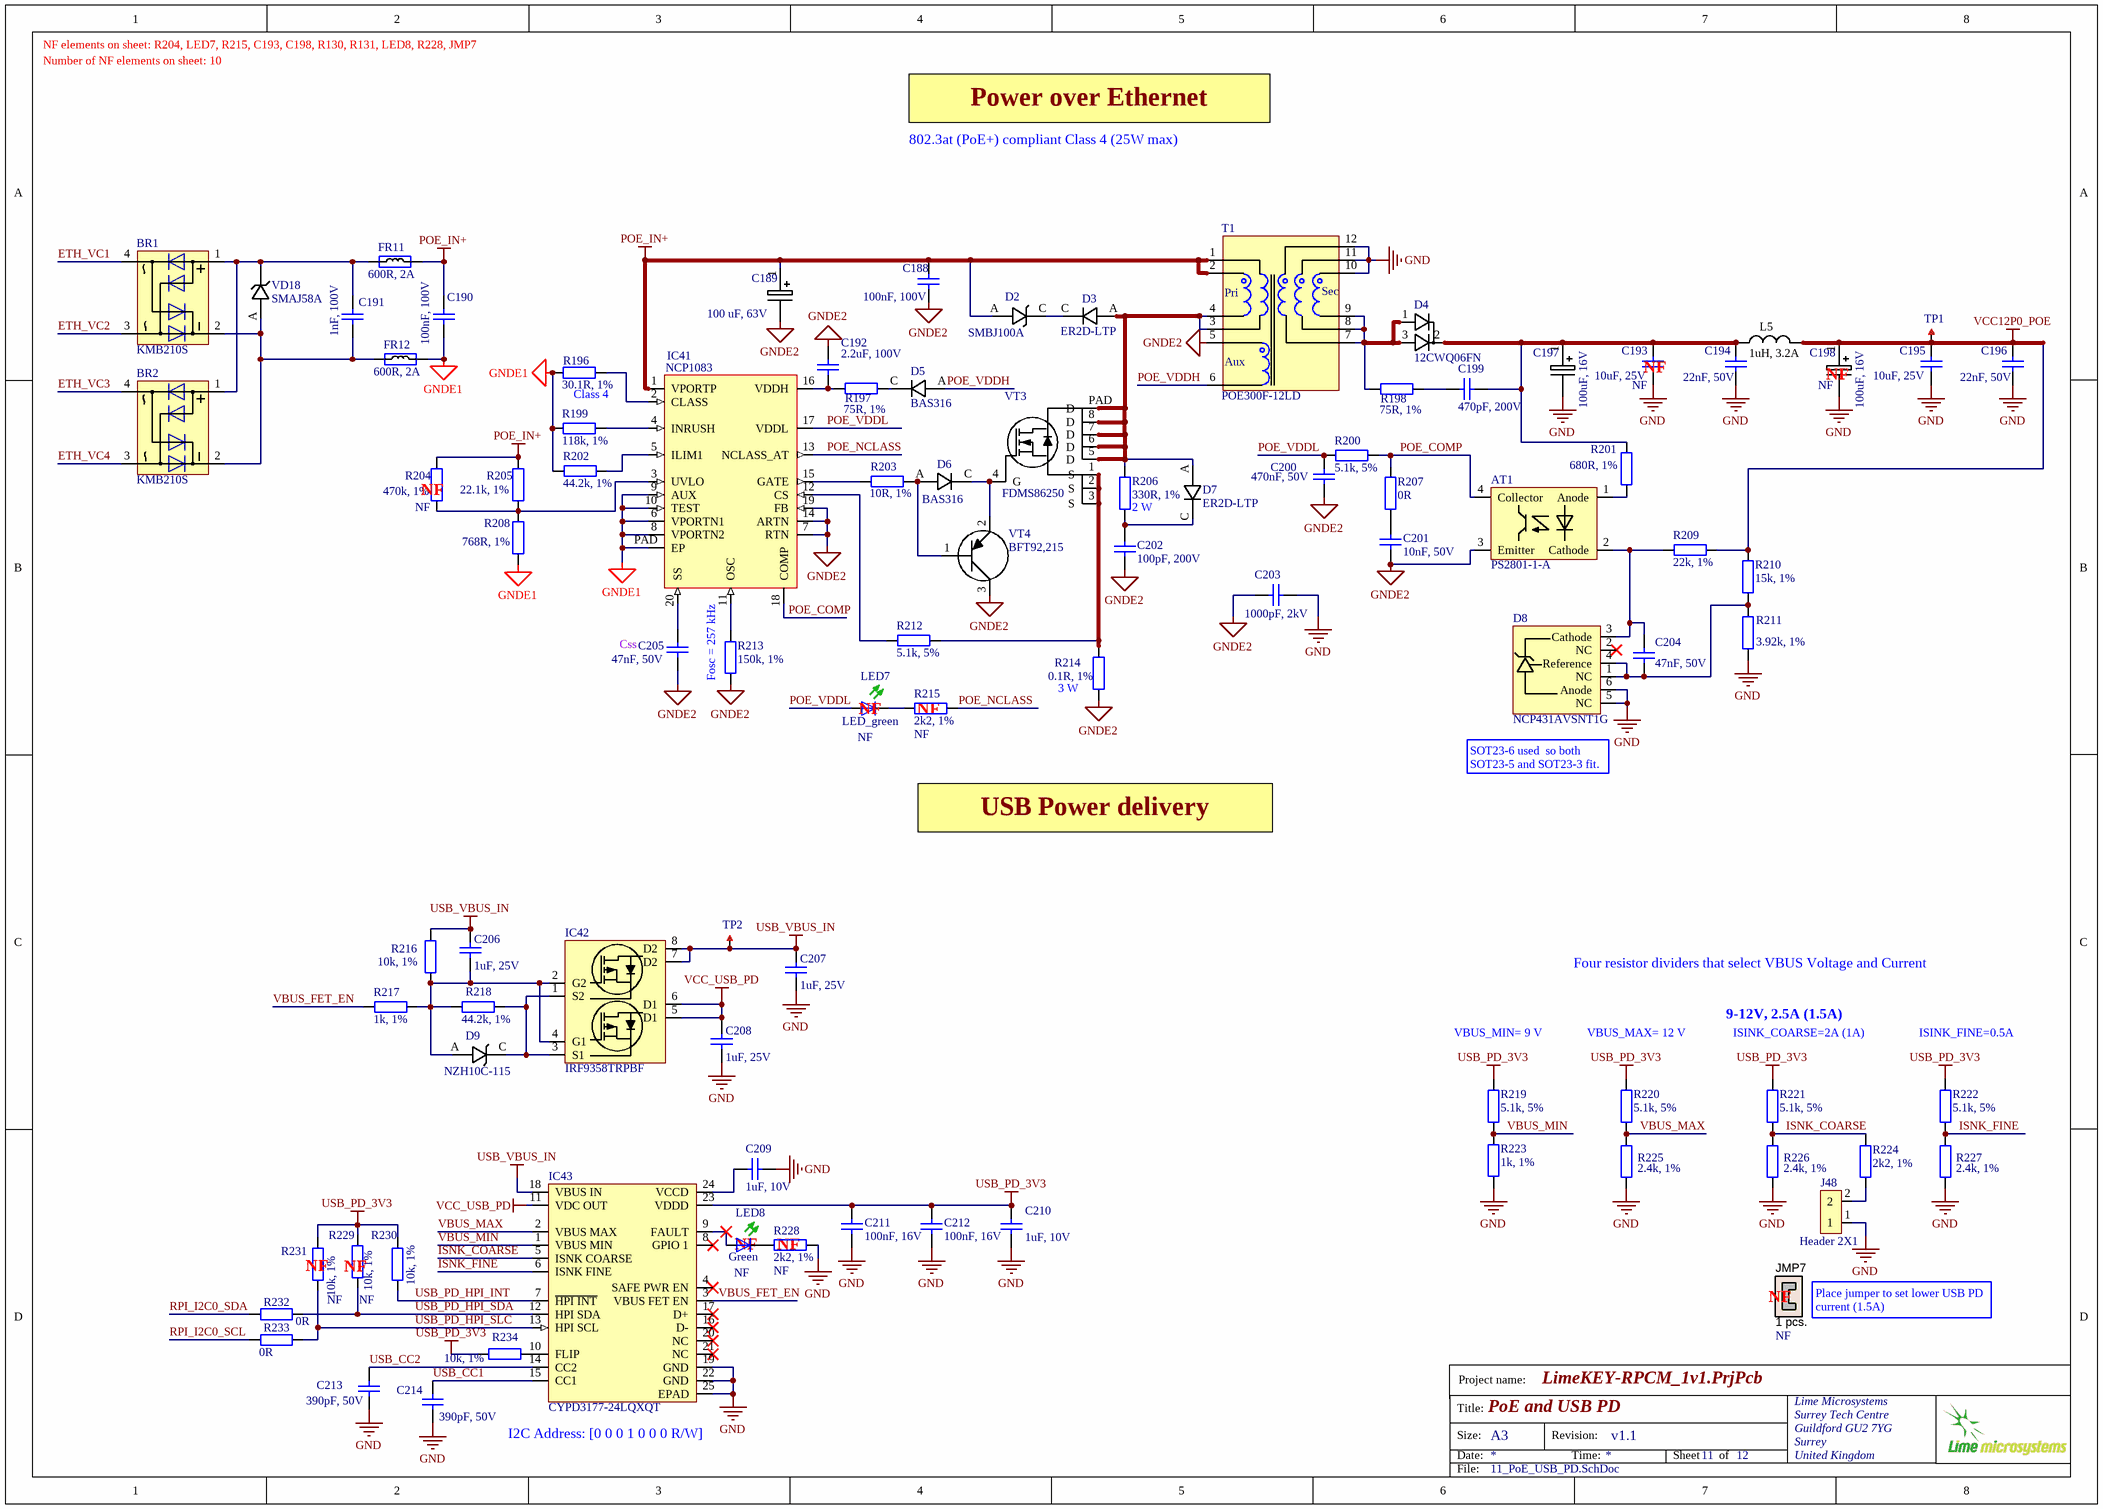
[diagram p10: 11_PoE_USB_PD.SchDoc]

### Parts
AT1  PS2801-1-A  [TCMT1107CT_optoisolator]
BR1  KMB210S  [KMB210S_RECTIFIER_BRIDGE]
BR2  KMB210S  [KMB210S_RECTIFIER_BRIDGE]
C188  100nF, 100V  [CAP0603]
C189  100 uF, 63V  [CAP_POL_D10_H10]
C190  100nF, 100V  [CAP0603]
C191  1nF, 100V  [CAP0603]
C192  2.2uF, 100V  [CAP1206]
C193  10uF, 25V  Assembly Info: NF  [CAP0805]
C194  22nF, 50V  [CAP0402]
C195  10uF, 25V  [CAP0805]
C196  22nF, 50V  [CAP0402]
C197  100uF, 16V  [CAP_POL_SIZE_F_v2]
C198  100uF, 16V  Assembly Info: NF  [CAP_POL_SIZE_F_v2]
C199  470pF, 200V  [CAP0603]
C200  470nF, 50V  [CAP0402]
C201  10nF, 50V  [CAP0402]
C202  100pF, 200V  [CAP0603]
C203  1000pF, 2kV  [CAP1812]
C204  47nF, 50V  [CAP0603]
C205  47nF, 50V  [CAP0603]
C206  1uF, 25V  [CAP0603]
C207  1uF, 25V  [CAP0603]
C208  1uF, 25V  [CAP0603]
C209  1uF, 10V  [CAP0402]
C210  1uF, 10V  [CAP0402]
C211  100nF, 16V  [CAP0402]
C212  100nF, 16V  [CAP0402]
C213  390pF, 50V  [CAP0402]
C214  390pF, 50V  [CAP0402]
D2  SMBJ100A  [SMBJ100A_DIODE_DO-214AA]
D3  ER2D-LTP  [ER2D-LTP_DIODE_DO-214AA]
D4  12CWQ06FN  [12CWQ06FN_diode_array_DPAK]
D5  BAS316  [BAS316_DIODE_SOD323]
D6  BAS316  [BAS316_DIODE_SOD323]
D7  ER2D-LTP  [ER2D-LTP_DIODE_DO-214AA]
D8  NCP431AVSNT1G  [SOT23-6]
D9  NZH10C-115  [NZH10C,115_shottky_diode_SOD123]
FR11  600R, 2A  [RES0805]
FR12  600R, 2A  [RES0805]
IC41  NCP1083  [NCP1083_PoE_controller_TSSOP20]
IC42  IRF9358TRPBF  [IRF9358TRPBF_DUAL_NMOS_SOIC8]
IC43  CYPD3177-24LQXQT  [USB_POWER_DISTR_CYPD3177_QFN24]
J48  Header 2X1  [HDR_1x2]
JMP7  1 pcs.  Assembly Info: NF  (mechanical)
L5  1uH, 3.2A  [NRS4018T3R3MDGJ_inductor]
LED7  LED_green  Assembly Info: NF  [LED-0603-GREEN]
LED8  Green  Assembly Info: NF  [LED-0603-GREEN]
R196  30.1R, 1%  [RES0402]
R197  75R, 1%  [RES0402]
R198  75R, 1%  [RES0402]
R199  118k, 1%  [RES0402]
R200  5.1k, 5%  [RES0402]
R201  680R, 1%  [RES0402]
R202  44.2k, 1%  [RES0402]
R203  10R, 1%  [RES0603]
R204  470k, 1%  Assembly Info: NF  [RES0402]
R205  22.1k, 1%  [RES0402]
R206  330R, 1%  [RES2512]
R207  0R  [RES0402]
R208  768R, 1%  [RES0402]
R209  22k, 1%  [RES0402]
R210  15k, 1%  [RES0402]
R211  3.92k, 1%  [RES0402]
R212  5.1k, 5%  [RES0402]
R213  150k, 1%  [RES0402]
R214  0.1R, 1%  [RES2512]
R215  2k2, 1%  Assembly Info: NF  [RES0402]
R216  10k, 1%  [RES0402]
R217  1k, 1%  [RES0402]
R218  44.2k, 1%  [RES0402]
R219  5.1k, 5%  [RES0402]
R220  5.1k, 5%  [RES0402]
R221  5.1k, 5%  [RES0402]
R222  5.1k, 5%  [RES0402]
R223  1k, 1%  [RES0402]
R224  2k2, 1%  [RES0402]
R225  2.4k, 1%  [RES0402]
R226  2.4k, 1%  [RES0402]
R227  2.4k, 1%  [RES0402]
R228  2k2, 1%  Assembly Info: NF  [RES0402]
R229  10k, 1%  Assembly Info: NF  [RES0402]
R230  10k, 1%  [RES0402]
R231  10k, 1%  Assembly Info: NF  [RES0402]
R232  0R  [RES0402]
R233  0R  [RES0402]
R234  10k, 1%  [RES0402]
T1  POE300F-12LD  [POE300F50LD_TRANSFORMER]
TP1  TESTPOINT_PAD  [TP_PAD_1p5MM]  (value not drawn)  (no BOM)
TP2  TESTPOINT_PAD  [TP_PAD_1p5MM]  (value not drawn)  (no BOM)
VD18  SMAJ58A  [SMAJ58A_shottky_diode]
VT3  FDMS86250  [FDMS86250_NMOS_POWER56]
VT4  BFT92,215  [BFT92,215_PNP_STO23-3]

### Nets
GND: C193.1 C194.2 C195.1 C196.2 C197.2 C198.2 C203.1 C207.1 C208.1 C209.1 C210.1 C211.2 C212.2 C213.2 C214.2 D8.5(NC) D8.6(Anode) IC43.19(GND) IC43.22(GND) IC43.25(EPAD) J48.1 R211.2 R223.2 R225.1 R226.1 R227.1 R228.2 T1.10 T1.11 T1.12
GNDE1: C190.1 FR12.2 IC41.6(VPORTN1) IC41.8(VPORTN2) IC41.9(AUX) IC41.10(TEST) IC41.PAD(EP) R196.1 R199.1 R202.2 R208.2
GNDE2: AT1.3(Emitter) C188.1 C189.2 C192.2 C200.1 C201.1 C202.2 C203.2 C205.1 IC41.7(RTN) IC41.14(ARTN) IC41.19(FB) R213.1 R214.1 T1.5 VT4.3(C)
POE_IN+: C188.2 C189.1 C190.2 D2.A FR11.2 IC41.1(VPORTP) R204.2 R205.2 T1.1 T1.2
USB_PD_3V3: C210.2 C211.1 C212.1 IC43.23(VDDD) R219.1 R220.1 R221.1 R222.1 R229.2 R230.2 R231.2 R234.1
USB_VBUS_IN: C206.2 C207.2 IC42.7(D2) IC42.8(D2) IC43.18(VBUS_IN) R216.2 TP2.1
VCC12P0_POE: C195.2 C196.1 C198.1 L5.2 R209.1 R210.1 TP1.1
VCC_USB_PD: C208.2 IC42.5(D1) IC42.6(D1) IC43.11(VDC_OUT)
ETH_VC1: BR1.4
ETH_VC2: BR1.3
ETH_VC3: BR2.4
ETH_VC4: BR2.3
ISNK_COARSE: IC43.5(ISNK_COARSE) R221.2 R224.2 R226.2
ISNK_FINE: IC43.6(ISNK_FINE) R222.2 R227.2
POE_COMP: AT1.4(Collector) IC41.18(COMP) R200.1 R207.1
POE_NCLASS: IC41.13(NCLASS_AT) R215.2
POE_VDDH: D5.A T1.6
POE_VDDL: C200.2 IC41.17(VDDL) LED7.A R200.2
RPI_I2C0_SCL: R233.2
RPI_I2C0_SDA: R232.2
USB_CC1: C214.1 IC43.15(CC1)
USB_CC2: C213.1 IC43.14(CC2)
USB_PD_HPI_INT: IC43.7(~{HPI_INT}) R230.1
USB_PD_HPI_SDA: IC43.12(HPI_SDA) R229.1 R232.1
USB_PD_HPI_SLC: IC43.13(HPI_SCL) R231.1 R233.1
VBUS_FET_EN: IC43.3(VBUS_FET_EN) R217.2
VBUS_MAX: IC43.2(VBUS_MAX) R220.2 R225.2
VBUS_MIN: IC43.1(VBUS_MIN) R219.2 R223.1
NetAT1_1: AT1.1(Anode) R201.2
NetAT1_2: AT1.2(Cathode) C204.2 D8.3(Cathode) R209.2
NetBR1_1: BR1.1 BR2.1 C191.1 FR11.1 VD18.K
NetBR1_2: BR1.2 BR2.2 C191.2 FR12.1 VD18.A
NetC192_1: C192.1 IC41.16(VDDH) R197.1
NetC193_2: C193.2 C194.1 C197.1 C199.2 D4.2 L5.1 R201.1
NetC199_1: C199.1 R198.2
NetC201_2: C201.2 R207.2
NetC202_1: C202.1 D7.C R206.1
NetC204_1: C204.1 D8.1(NC) D8.4(Reference) R210.2 R211.1
NetC205_2: C205.2 IC41.20(SS)
NetC206_1: C206.1 D9.A IC42.2(G2) IC42.4(G1) R216.1 R217.1 R218.2
NetC209_2: C209.2 IC43.24(VCCD)
NetD2_C: D2.C D3.C
NetD3_A: D3.A D7.A R206.2 T1.3 T1.4 VT3.5(D) VT3.6(D) VT3.7(D) VT3.8(D) VT3.PAD(D)
NetD4_1: D4.1 D4.3 R198.1 T1.7 T1.8 T1.9
NetD5_C: D5.C R197.2
NetD6_A: D6.A R203.1 VT4.1(S)
NetD6_C: D6.C VT3.4(G) VT4.2(E)
NetD9_C: D9.C IC42.1(S2) IC42.3(S1) R218.1
NetIC41_2: IC41.2(CLASS) R196.2
NetIC41_3: IC41.3(UVLO) R204.1 R205.1 R208.1
NetIC41_4: IC41.4(INRUSH) R199.2
NetIC41_5: IC41.5(ILIM1) R202.1
NetIC41_11: IC41.11(OSC) R213.2
NetIC41_12: IC41.12(CS) R212.2
NetIC41_15: IC41.15(GATE) R203.2
NetIC43_9: IC43.9(FAULT) LED8.A
NetIC43_10: IC43.10(FLIP) R234.2
NetJ48_2: J48.2 R224.1
NetLED7_K: LED7.K(C) R215.1
NetLED8_K: LED8.K(C) R228.1
NetR212_1: R212.1 R214.2 VT3.1(S) VT3.2(S) VT3.3(S)

Not connected (* = marked no-connect by the designer): D8 2(NC)*; IC43 4(SAFE_PWR_EN)* 8(GPIO_1)* 16(D-)* 17(D+)* 20(NC)* 21(NC)*; JMP7 1 2

### Notes on the sheet
- NF elements on sheet: R204, LED7, R215, C193, C198, R130, R131, LED8, R228, JMP7
- Number of NF elements on sheet: 10
- 802.3at (PoE+) compliant Class 4 (25W max)
- Power over Ethernet
- (near C193) NF
- (near C198) NF
- Class 4
- (near R204) NF
- (near R206) 2 W
- Css
- Fosc = 257 kHz
- (near LED7) NF
- (near R215) NF
- (near R214) 3 W
- (near D8) SOT23-6 used  so both SOT23-5 and SOT23-3 fit.
- USB Power delivery
- Four resistor dividers that select VBUS Voltage and Current
- (near R219) VBUS_MIN= 9 V
- (near R220) VBUS_MAX= 12 V
- 9-12V, 2.5A (1.5A)
- (near R221) ISINK_COARSE=2A (1A)
- (near R222) ISINK_FINE=0.5A
- NF
- (near R228) NF
- (near R231) NF
- (near R229) NF
- (near JMP7) NF
- Place jumper to set lower USB PD current (1.5A)
- (near IC43) I2C Address: [0 0 0 1 0 0 0 R/W]
- Project name:
- Title:
- Size:
- Date:
- A3
- Revision:
- Time:
- Sheet
- of
- File:
- (in symbol POE300F-50LD_transformer) Pri; Sec; Aux